# Altium schematic sheet LAUNCHXL-F28379D_0.SchDoc
size 301 x 239 mm
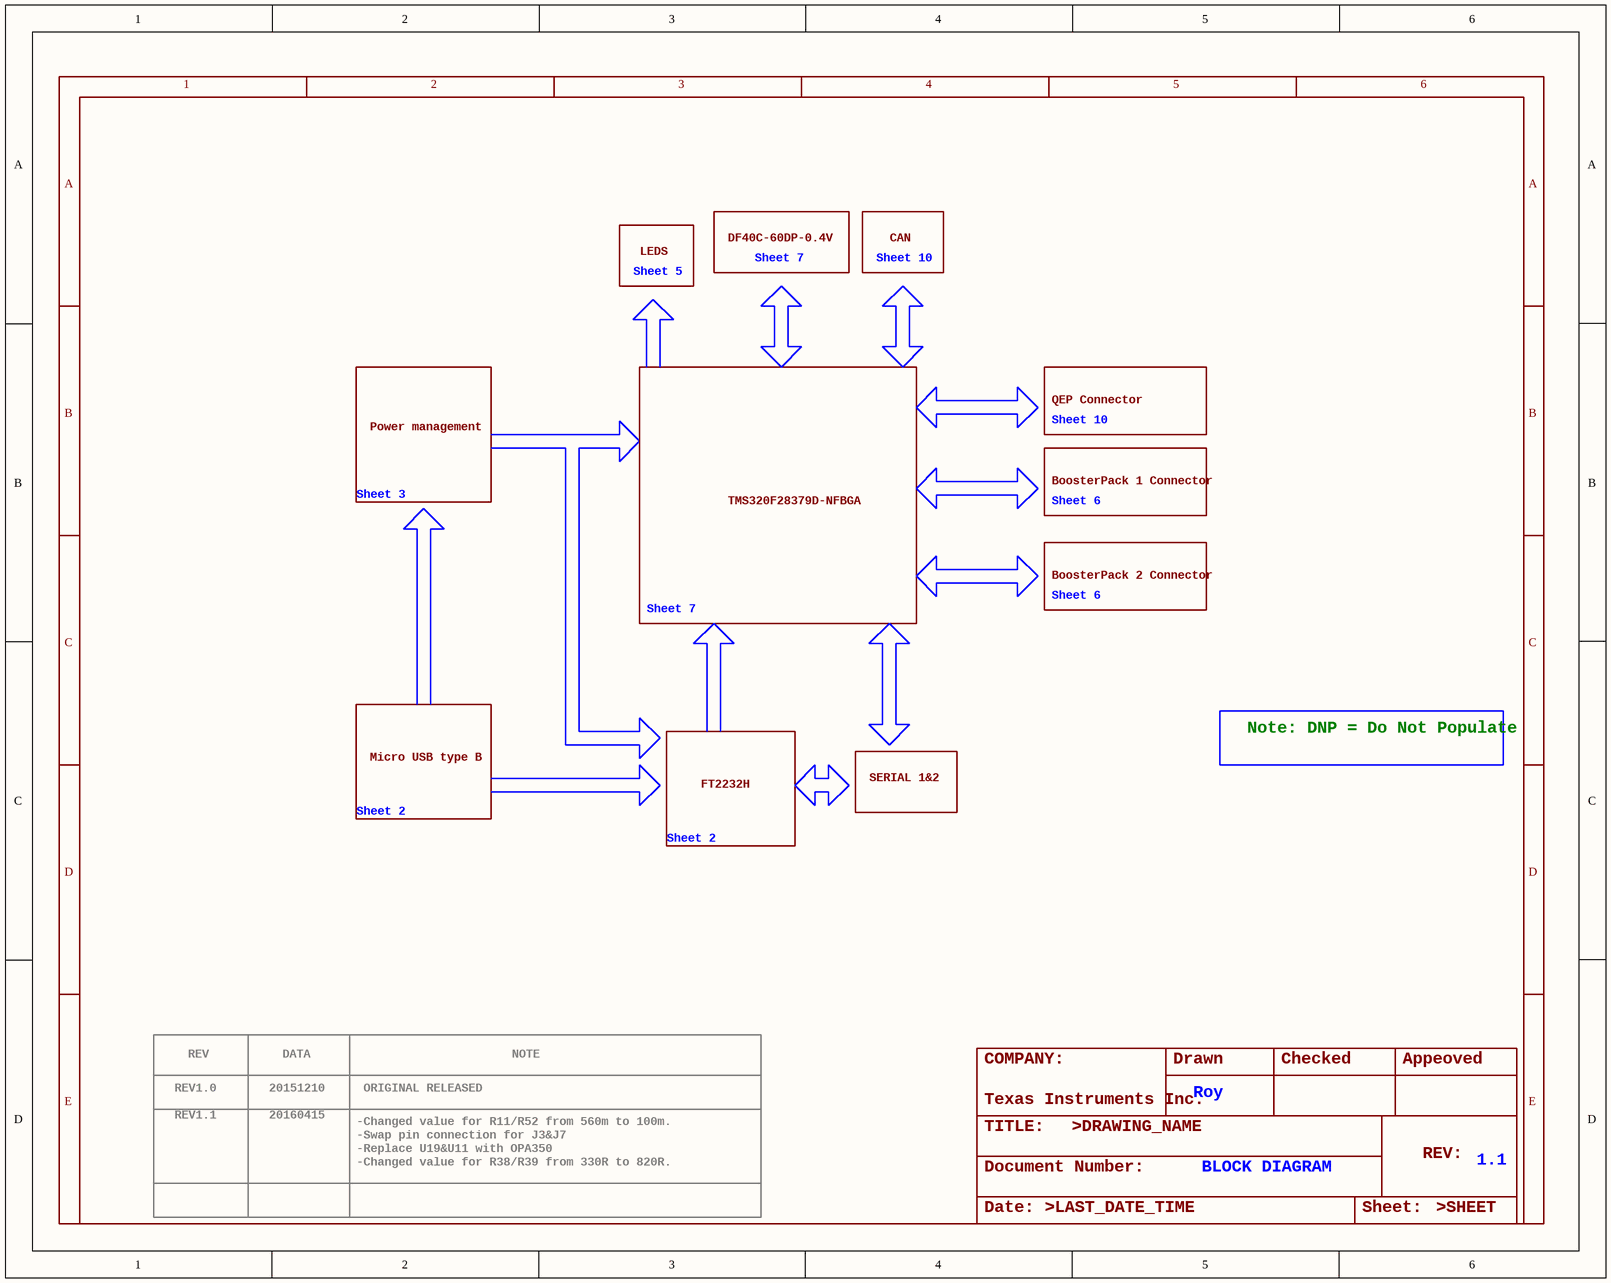
[diagram p0: LAUNCHXL-F28379D_0.SchDoc]

## Parts
FRAME3  FRAME_A_L  (value not drawn)

## Notes on the sheet
- Sheet 5
- LEDS
- DF40C-60DP-0.4V
- Sheet 7
- Sheet 10
- CAN
- QEP Connector
- Sheet 3
- Power management
- BoosterPack 1 Connector
- TMS320F28379D-NFBGA
- Sheet 6
- BoosterPack 2 Connector
- Micro USB type B
- Note: DNP = Do Not Populate
- Sheet 2
- FT2232H
- SERIAL 1&2
- REV1.0
- REV
- 20151210
- DATA
- ORIGINAL RELEASED
- NOTE
- COMPANY:
- Drawn
- Roy
- Checked
- Appeoved
- REV1.1
- 20160415
- -Changed value for R11/R52 from 560m to 100m.
- -Swap pin connection for J3&J7
- -Replace U19&U11 with OPA350
- -Changed value for R38/R39 from 330R to 820R.
- TITLE:
- Document Number:
- Texas
  Instruments Inc.
- >DRAWING_NAME
- BLOCK DIAGRAM
- REV:
- 1.1
- Date:
- >LAST_DATE_TIME
- Sheet:
- >SHEET
- (in symbol FRAME_A_L) 1; 2; 3; 4; 5; 6; A; B; C; D; E

## Library data of the parts
FRAME3 = FRAME_A_L: <b>FRAME</b> A Size , 8 1/2 x 11 INCH, Landscape<p>